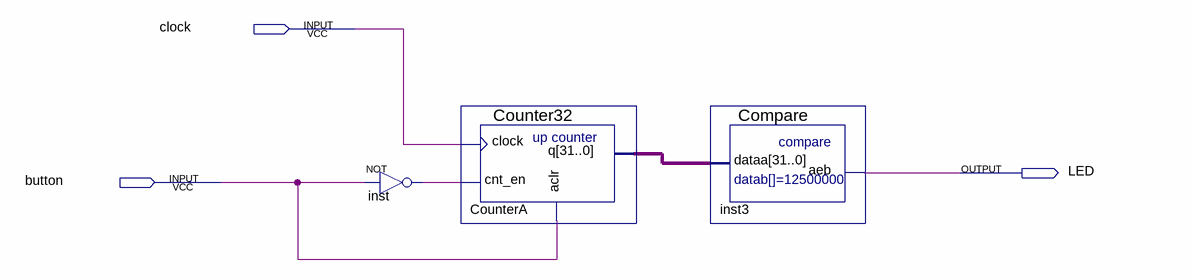
[diagram p0: schematic sheet]
// Quartus schematic debounce_p.bdf as structural Verilog: 3 symbols, 3 pins
module debounce_p (
  input  clock,
  input  button,
  output LED
);

  wire inst_out;
  wire [31:0] CounterA_q;

  not inst (inst_out, button);
  Counter32 CounterA (.clock(clock), .cnt_en(inst_out), .aclr(button), .q(CounterA_q));
  Compare inst3 (.dataa(CounterA_q), .aeb(LED));
endmodule
